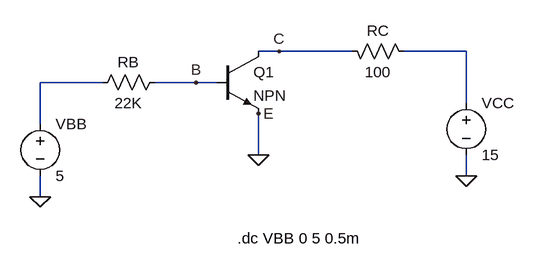
[diagram p0: schematic Draft1.asc]
Draft1.asc, the LTspice schematic file:
Version 4
SHEET 1 880 680
WIRE 400 -160 368 -160
WIRE 512 -160 400 -160
WIRE 688 -160 592 -160
WIRE 128 -112 32 -112
WIRE 272 -112 208 -112
WIRE 304 -112 272 -112
WIRE 688 -80 688 -160
WIRE 32 -48 32 -112
WIRE 368 0 368 -64
WIRE 688 32 688 0
WIRE 32 64 32 32
FLAG 688 32 0
FLAG 368 0 0
FLAG 32 64 0
FLAG 272 -112 B
FLAG 400 -160 C
FLAG 368 -64 E
SYMBOL npn 304 -160 R0
SYMATTR InstName Q1
SYMBOL res 496 -176 M90
WINDOW 0 0 56 VBottom 2
WINDOW 3 32 56 VTop 2
SYMATTR InstName RC
SYMATTR Value 100
SYMBOL res 224 -128 R90
WINDOW 0 0 56 VBottom 2
WINDOW 3 32 56 VTop 2
SYMATTR InstName RB
SYMATTR Value 22K
SYMBOL voltage 688 -96 R0
SYMATTR InstName VCC
SYMATTR Value 15
SYMBOL voltage 32 -64 R0
SYMATTR InstName VBB
SYMATTR Value 5
TEXT 336 128 Left 2 !.dc VBB 0 5 0.5m

The netlist it stands for:
* Draft1.asc
Q1 C B 0 0 NPN
RC C N001 100
RB B N002 22K
VCC N001 0 15
VBB N002 0 5
.model NPN NPN
.model PNP PNP
.lib standard.bjt
.dc VBB 0 5 0.5m
.backanno
.end